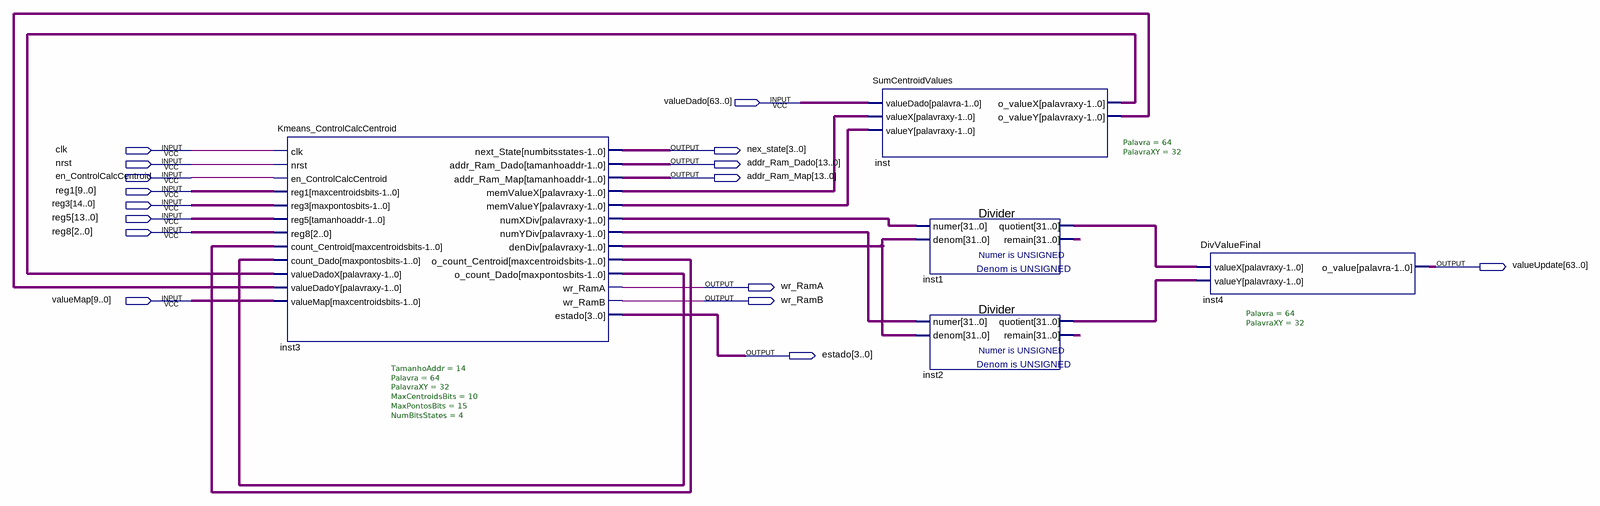
[diagram p0: schematic sheet]
// Quartus schematic Kmeans_CalcCentroidModule.bdf as structural Verilog: 5 symbols, 16 pins
module Kmeans_CalcCentroidModule (
  input  [63:0] valueDado,
  input  clk,
  input  nrst,
  input  en_ControlCalcCentroid,
  input  [9:0] reg1,
  input  [14:0] reg3,
  input  [13:0] reg5,
  input  [2:0] reg8,
  input  [9:0] valueMap,
  output [3:0] nex_state,
  output [13:0] addr_Ram_Dado,
  output [13:0] addr_Ram_Map,
  output [63:0] valueUpdate,
  output wr_RamA,
  output wr_RamB,
  output [3:0] estado
);

  wire [9:0] inst3_o_count_centroid;
  wire [14:0] inst3_o_count_dado;
  wire [31:0] inst1_quotient, inst1_remain, inst2_quotient, inst2_remain, inst3_dendiv, inst3_memvaluex,
       inst3_memvaluey, inst3_numxdiv, inst3_numydiv, inst_o_valuex, inst_o_valuey;

  Kmeans_ControlCalcCentroid #(.TamanhoAddr(14), .Palavra(64), .PalavraXY(32), .MaxCentroidsBits(10), .MaxPontosBits(15), .NumBitsStates(4)) inst3 (
    .clk(clk), .nrst(nrst), .en_ControlCalcCentroid(en_ControlCalcCentroid), .reg1(reg1), .reg3(reg3),
    .reg5(reg5), .reg8(reg8), .count_Centroid(inst3_o_count_centroid), .count_Dado(inst3_o_count_dado),
    .valueDadoX(inst_o_valuex), .valueDadoY(inst_o_valuey), .valueMap(valueMap), .next_State(nex_state),
    .addr_Ram_Dado(addr_Ram_Dado), .addr_Ram_Map(addr_Ram_Map), .memValueX(inst3_memvaluex),
    .memValueY(inst3_memvaluey), .numXDiv(inst3_numxdiv), .numYDiv(inst3_numydiv), .denDiv(inst3_dendiv),
    .o_count_Centroid(inst3_o_count_centroid), .o_count_Dado(inst3_o_count_dado), .wr_RamA(wr_RamA),
    .wr_RamB(wr_RamB), .estado(estado));
  SumCentroidValues #(.Palavra(64), .PalavraXY(32)) inst (
    .valueDado(valueDado), .valueX(inst3_memvaluex), .valueY(inst3_memvaluey), .o_valueX(inst_o_valuex),
    .o_valueY(inst_o_valuey));
  Divider inst1 (.numer(inst3_numxdiv), .denom(inst3_dendiv), .quotient(inst1_quotient), .remain(inst1_remain));
  Divider inst2 (.numer(inst3_numydiv), .denom(inst3_dendiv), .quotient(inst2_quotient), .remain(inst2_remain));
  DivValueFinal #(.Palavra(64), .PalavraXY(32)) inst4 (
    .valueX(inst1_quotient), .valueY(inst2_quotient), .o_value(valueUpdate));
endmodule
